# EAGLE schematic pontos_cegos_pth (EAGLE 7.6.0)
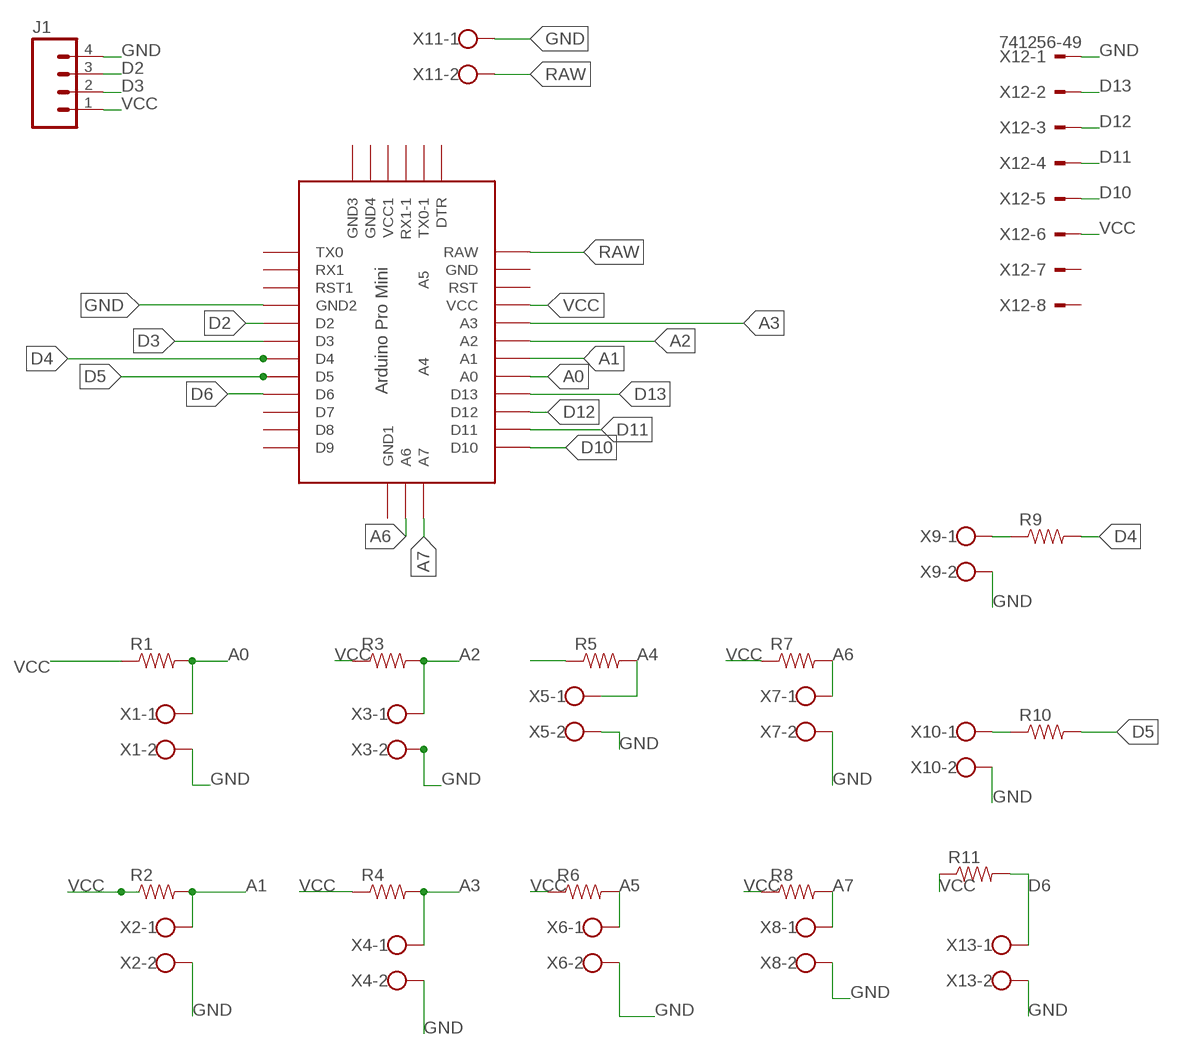
[diagram p0: schematic, sheet 1]

## Parts
J1  M04LONGPADS  [1X04_LONGPADS]
R1  RESISTORAXIAL-0.3  [AXIAL-0.3]
R2  RESISTORAXIAL-0.3  [AXIAL-0.3]
R3  RESISTORAXIAL-0.3  [AXIAL-0.3]
R4  RESISTORAXIAL-0.3  [AXIAL-0.3]
R5  RESISTORAXIAL-0.3  [AXIAL-0.3]
R6  RESISTORAXIAL-0.3  [AXIAL-0.3]
R7  RESISTORAXIAL-0.3  [AXIAL-0.3]
R8  RESISTORAXIAL-0.3  [AXIAL-0.3]
R9  RESISTORAXIAL-0.3  [AXIAL-0.3]
R10  RESISTORAXIAL-0.3  [AXIAL-0.3]
R11  RESISTORAXIAL-0.3  [AXIAL-0.3]
U$1  ABK-PRO-MINI  [ABK-PRO-MINI]
X1  W237-102  [W237-102]
X2  W237-102  [W237-102]
X3  W237-102  [W237-102]
X4  W237-102  [W237-102]
X5  W237-102  [W237-102]
X6  W237-102  [W237-102]
X7  W237-102  [W237-102]
X8  W237-102  [W237-102]
X9  W237-102  [W237-102]
X10  W237-102  [W237-102]
X11  W237-102  [W237-102]
X12  741256-49  [741256-49]
X13  W237-102  [W237-102]

## Nets
A0: R1.P$2 U$1.A0 X1.1
A1: R2.P$2 U$1.A1 X2.1
A2: R3.P$2 U$1.A2 X3.1
A3: R4.P$2 U$1.A3 X4.1
A4: R5.P$2 X5.1
A5: R6.P$2 X6.1
A6: R7.P$2 U$1.A6 X7.1
A7: R8.P$2 U$1.A7 X8.1
D2: J1.3 U$1.D2
D3: J1.2 U$1.D3
D4: R9.P$2 U$1.D4
D5: R10.P$2 U$1.D5
D6: R11.P$2 U$1.D6 X13.1
D10: U$1.D10 X12.5
D11: U$1.D11 X12.4
D12: U$1.D12 X12.3
D13: U$1.D13 X12.2
GND: J1.4 U$1.GND1(GND2) X1.2 X2.2 X3.2 X4.2 X5.2 X6.2 X7.2 X8.2 X9.2 X10.2 X11.1 X12.1 X13.2
N$5: R9.P$1 X9.1
N$14: R10.P$1 X10.1
RAW: U$1.RAW X11.2
VCC: J1.1 R1.P$1 R2.P$1 R3.P$1 R4.P$1 R5.P$1 R6.P$1 R7.P$1 R8.P$1 R11.P$1 U$1.VCC X12.6
Unconnected: U$1.A4 U$1.A5 U$1.D7 U$1.D8 U$1.D9 U$1.DTR U$1.GND U$1.GND2(GND3) U$1.GND3(GND4) U$1.GND4(GND1) U$1.RST U$1.RST1 U$1.RX1 U$1.RX1-1 U$1.TX0 U$1.TX0-1 U$1.VCC1 X12.7 X12.8

## Library data of the parts
J1 = SparkFun-Connectors:M04: Header 4 Standard 4-pin 0.1" header. Use with straight break away headers (SKU : PRT-00116), right angle break away headers (PRT-00553), swiss pins (PRT-00743), machine pins (PRT-00117), and female headers (PRT-00115). Molex polarized connector foot print use with SKU : PRT-08231 with associated crimp pins and housings. 1MM SMD Version SKU: PRT-10208; PROD_ID: CONN-09696
R1-R11 = SparkFun-Resistors:RESISTOR: Resistor Basic schematic elements and footprints for 0603, 1206, and PTH resistors.
U$1 = Arduino-clone:ABK-PRO-MINI: ABK Pro-Mini Arduino Clone
X1-X11 X13 = con-wago-500:W237-102: WAGO SCREW CLAMP; MPN: 237-102; OC_FARNELL: unknown; OC_NEWARK: 70K9898
X12 = con-conrad:741256-49: Connector with Kabel

## Net classes
0 default: width 0.406 mm